# Altium schematic sheet STM32H733_PINOUT.SchDoc
size C; SheetNumber: 3; SheetTotal: 5
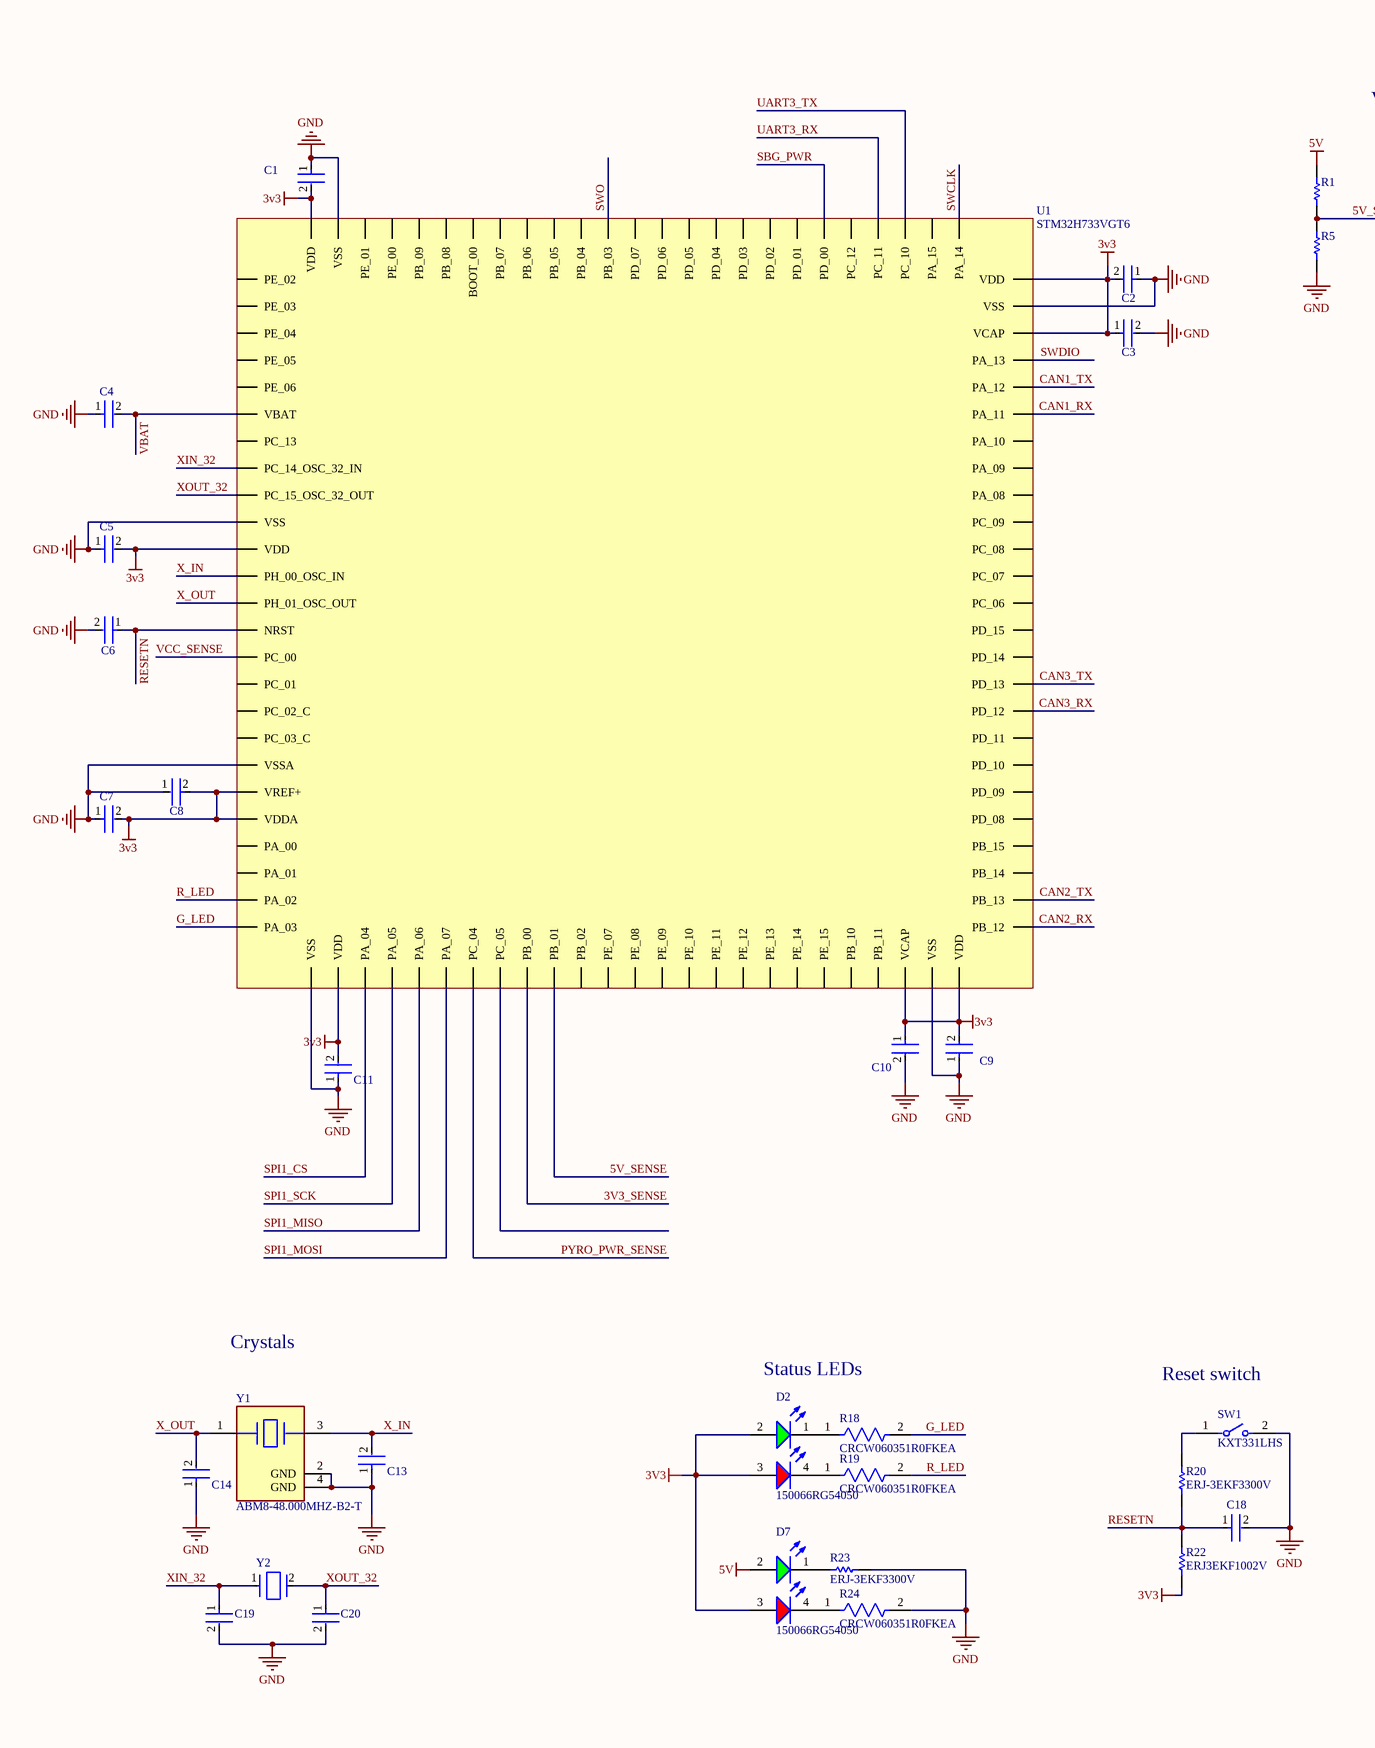
[diagram p0: STM32H733_PINOUT.SchDoc, left]
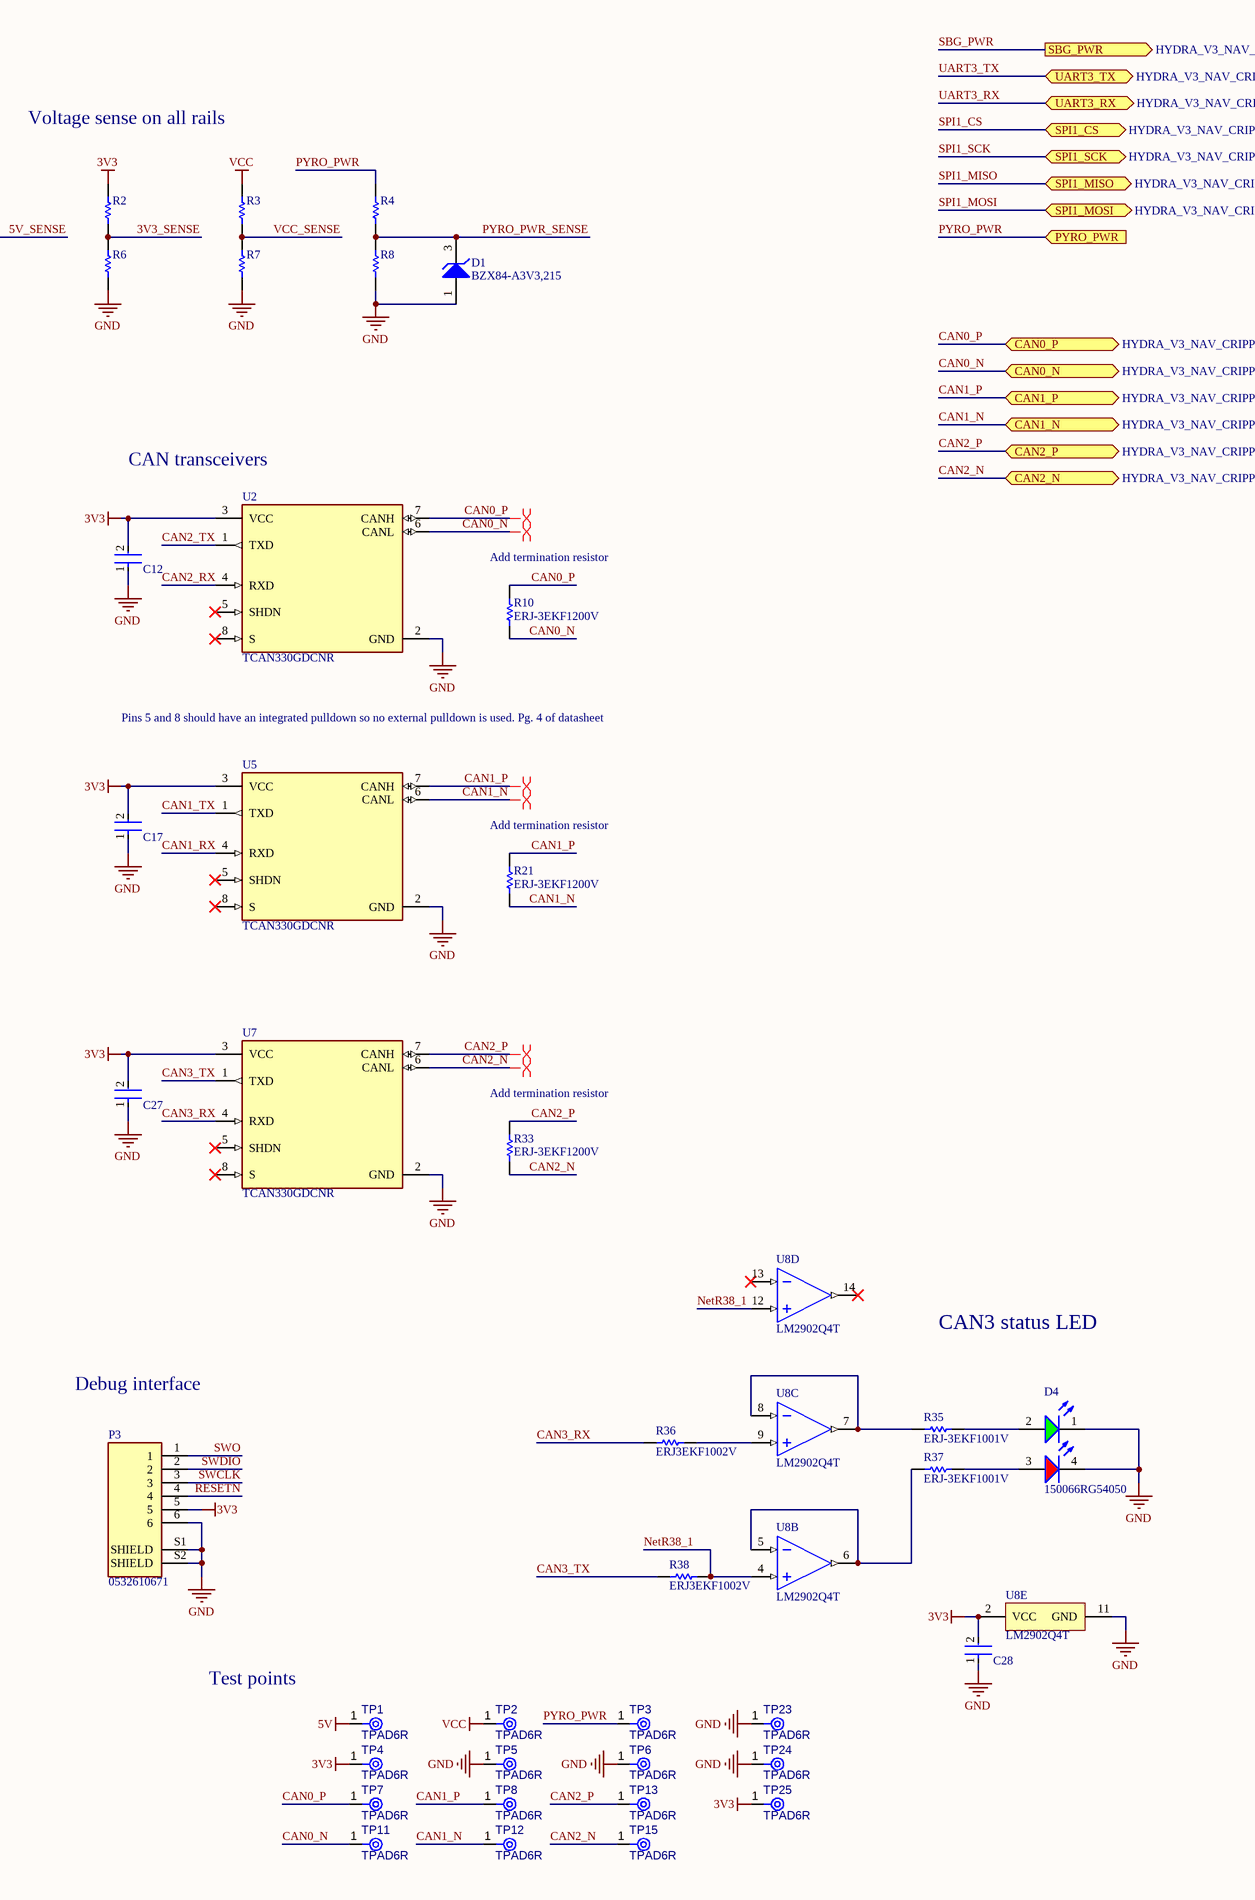
[diagram p1: STM32H733_PINOUT.SchDoc, right]

## Parts
C1  CC0402JRNPO9BN500  [FP-C0402-BB-MFG]  (value not drawn)
C2  CC0402JRNPO9BN500  [FP-C0402-BB-MFG]  (value not drawn)
C3  C1005X7S1A225K050BC  [FP-C1005-050-0_15-0_1-MFG]  (value not drawn)
C4  CC0402JRNPO9BN500  [FP-C0402-BB-MFG]  (value not drawn)
C5  CC0402JRNPO9BN500  [FP-C0402-BB-MFG]  (value not drawn)
C6  C0402C104K8PACTU  [FP-C0402-BB-MFG]  (value not drawn)
C7  CC0402JRNPO9BN500  [FP-C0402-BB-MFG]  (value not drawn)
C8  GRM155R71C104KA88D  [FP-GRM15-MFG]  (value not drawn)
C9  CC0402JRNPO9BN500  [FP-C0402-BB-MFG]  (value not drawn)
C10  C1005X7S1A225K050BC  [FP-C1005-050-0_15-0_1-MFG]  (value not drawn)
C11  CC0402JRNPO9BN500  [FP-C0402-BB-MFG]  (value not drawn)
C12  C0402C104K8PACTU  [FP-C0402-BB-MFG]  (value not drawn)
C13  08051A6R8CAT2A  [FP-0805-L_2_01_0_2-W_1_25-MFG]  (value not drawn)
C14  08051A6R8CAT2A  [FP-0805-L_2_01_0_2-W_1_25-MFG]  (value not drawn)
C17  C0402C104K8PACTU  [FP-C0402-BB-MFG]  (value not drawn)
C18  C0402C104K8PACTU  [FP-C0402-BB-MFG]  (value not drawn)
C19  C0805C180J5GACTU  [FP-C0805C-DN-MFG]  (value not drawn)
C20  C0805C180J5GACTU  [FP-C0805C-DN-MFG]  (value not drawn)
C27  C0402C104K8PACTU  [FP-C0402-BB-MFG]  (value not drawn)
C28  C0402C104K8PACTU  [FP-C0402-BB-MFG]  (value not drawn)
D1  BZX84-A3V3,215  [SOT95P230X110-3N]
D2  150066RG54050  [WL-SBCD_0606]
D4  150066RG54050  [WL-SBCD_0606]
D7  150066RG54050  [WL-SBCD_0606]
P3  0532610671  [0532610671-Footprint-1]
R1  ERJ3EKF1002V  [RESC1609X55X30LL15T15]  (value not drawn)
R2  ERJ3EKF1002V  [RESC1609X55X30LL15T15]  (value not drawn)
R3  ERJ3EKF1002V  [RESC1609X55X30LL15T15]  (value not drawn)
R4  ERJ3EKF1002V  [RESC1609X55X30LL15T15]  (value not drawn)
R5  ERJ3EKF1002V  [RESC1609X55X30LL15T15]  (value not drawn)
R6  ERJ3EKF1002V  [RESC1609X55X30LL15T15]  (value not drawn)
R7  CRCW06032K70JNEA  [RESC1609X50X30ML10T20]  (value not drawn)
R8  CRCW06032K70JNEA  [RESC1609X50X30ML10T20]  (value not drawn)
R10  ERJ-3EKF1200V  [RESC1609X55X30ML15T15]
R18  CRCW060351R0FKEA  [FP-CRCW0603-e3-MFG]
R19  CRCW060351R0FKEA  [FP-CRCW0603-e3-MFG]
R20  ERJ-3EKF3300V  [RESC1608X55X30LL15T15]
R21  ERJ-3EKF1200V  [RESC1609X55X30ML15T15]
R22  ERJ3EKF1002V  [RESC1609X55X30LL15T15]
R23  ERJ-3EKF3300V  [RESC1608X55X30LL15T15]
R24  CRCW060351R0FKEA  [FP-CRCW0603-e3-MFG]
R33  ERJ-3EKF1200V  [RESC1609X55X30ML15T15]
R35  ERJ-3EKF1001V  [RESC1608X55X30LL15T15]
R36  ERJ3EKF1002V  [RESC1609X55X30LL15T15]
R37  ERJ-3EKF1001V  [RESC1608X55X30LL15T15]
R38  ERJ3EKF1002V  [RESC1609X55X30LL15T15]
SW1  KXT331LHS  [FP-KXT331LHS-MFG]
TP1  TPAD6R  [TP06R]  (no BOM)
TP2  TPAD6R  [TP06R]  (no BOM)
TP3  TPAD6R  [TP06R]  (no BOM)
TP4  TPAD6R  [TP06R]  (no BOM)
TP5  TPAD6R  [TP06R]  (no BOM)
TP6  TPAD6R  [TP06R]  (no BOM)
TP7  TPAD6R  [TP06R]  (no BOM)
TP8  TPAD6R  [TP06R]  (no BOM)
TP11  TPAD6R  [TP06R]  (no BOM)
TP12  TPAD6R  [TP06R]  (no BOM)
TP13  TPAD6R  [TP06R]  (no BOM)
TP15  TPAD6R  [TP06R]  (no BOM)
TP23  TPAD6R  [TP06R]  (no BOM)
TP24  TPAD6R  [TP06R]  (no BOM)
TP25  TPAD6R  [TP06R]  (no BOM)
U1  STM32H733VGT6  [STM32H733VGT6-Footprint-1]
U2  TCAN330GDCNR  [FP-DCN0008A-MFG]
U5  TCAN330GDCNR  [FP-DCN0008A-MFG]
U7  TCAN330GDCNR  [FP-DCN0008A-MFG]
U8  LM2902Q4T  [LM2902Q4T-Footprint-1]  (parts B,C,D,E of 5)
Y1  ABM8-48.000MHZ-B2-T  [FP-ABM8-MFG]
Y2  ECS-.327-12.5-1210-TR  [FP-ECX-1210-MFG]  (value not drawn)

## Ports
CAN0_N (bidir, see HYDRA_V3_NAV_CRIPPLED[5B]), CAN0_P (bidir, see HYDRA_V3_NAV_CRIPPLED[5B]), CAN1_N (bidir, see HYDRA_V3_NAV_CRIPPLED[5B]), CAN1_P (bidir, see HYDRA_V3_NAV_CRIPPLED[5B]), CAN2_N (bidir, see HYDRA_V3_NAV_CRIPPLED[5B]), CAN2_P (bidir, see HYDRA_V3_NAV_CRIPPLED[5B]), PYRO_PWR (in, see HYDRA_V3_NAV_CRIPPLED[4B]), SBG_PWR (out, see HYDRA_V3_NAV_CRIPPLED[5A], SBG[6A]), SPI1_CS (bidir, see HYDRA_V3_NAV_CRIPPLED[5B]), SPI1_MISO (bidir, see HYDRA_V3_NAV_CRIPPLED[5B]), SPI1_MOSI (bidir, see HYDRA_V3_NAV_CRIPPLED[5B]), SPI1_SCK (bidir, see HYDRA_V3_NAV_CRIPPLED[5B]), UART3_RX (bidir, see HYDRA_V3_NAV_CRIPPLED[5A]), UART3_TX (bidir, see HYDRA_V3_NAV_CRIPPLED[5A])

## Nets
3v3: C1.2 C2.2 C3.1 C5.2 C7.2 C8.2 C9.2 C10.1 C11.2 C12.2 C17.2 C27.2 C28.2 D2.2(A) D2.3(A) D7.3(A) P3.5 R2.2 R22.1 TP4.1(TP) TP25.1(TP) U1.11(VDD) U1.20(VREF+) U1.21(VDDA) U1.27(VDD) U1.48(VCAP) U1.50(VDD) U1.73(VCAP) U1.75(VDD) U1.100(VDD) U2.3(VCC) U5.3(VCC) U7.3(VCC) U8.2(VCC)
5V: D7.2(A) R1.2 TP1.1(TP)
GND: C1.1 C2.1 C3.2 C4.1 C5.1 C6.2 C7.1 C8.1 C9.1 C10.2 C11.1 C12.1 C13.1 C14.1 C17.1 C18.2 C19.2 C20.2 C27.1 C28.1 D1.1(A) D4.1(K) D4.4(K) P3.6 P3.S1(SHIELD) P3.S2(SHIELD) R5.1 R6.1 R7.1 R8.1 R23.2 R24.2 SW1.2 TP5.1(TP) TP6.1(TP) TP23.1(TP) TP24.1(TP) U1.10(VSS) U1.19(VSSA) U1.26(VSS) U1.49(VSS) U1.74(VSS) U1.99(VSS) U2.2(GND) U5.2(GND) U7.2(GND) U8.11(GND) Y1.2(GND) Y1.4(GND)
VCC: R3.2 TP2.1(TP)
3V3_SENSE: R2.1 R6.2 U1.34(PB_00)
5V_SENSE: R1.1 R5.2 U1.35(PB_01)
CAN0_N: R10.1 TP11.1(TP) U2.6(CANL) ; port CAN0_N
CAN0_P: R10.2 TP7.1(TP) U2.7(CANH) ; port CAN0_P
CAN1_N: R21.1 TP12.1(TP) U5.6(CANL) ; port CAN1_N
CAN1_P: R21.2 TP8.1(TP) U5.7(CANH) ; port CAN1_P
CAN1_RX: U1.70(PA_11) U5.4(RXD)
CAN1_TX: U1.71(PA_12) U5.1(TXD)
CAN2_N: R33.1 TP15.1(TP) U7.6(CANL) ; port CAN2_N
CAN2_P: R33.2 TP13.1(TP) U7.7(CANH) ; port CAN2_P
CAN2_RX: U1.51(PB_12) U2.4(RXD)
CAN2_TX: U1.52(PB_13) U2.1(TXD)
CAN3_RX: R36.1 U1.59(PD_12) U7.4(RXD)
CAN3_TX: R38.2 U1.60(PD_13) U7.1(TXD)
G_LED: R18.2 U1.25(PA_03)
NetR38_1: R38.1 U8.4(2IN+) U8.12(4IN+)
PYRO_PWR: R4.2 TP3.1(TP) ; port PYRO_PWR
PYRO_PWR_SENSE: D1.3(K) R4.1 R8.2 U1.32(PC_04)
R_LED: R19.2 U1.24(PA_02)
RESETN: C6.1 C18.1 P3.4 R20.1 R22.2 U1.14(NRST)
SBG_PWR: U1.81(PD_00) ; port SBG_PWR
SPI1_CS: U1.28(PA_04) ; port SPI1_CS
SPI1_MISO: U1.30(PA_06) ; port SPI1_MISO
SPI1_MOSI: U1.31(PA_07) ; port SPI1_MOSI
SPI1_SCK: U1.29(PA_05) ; port SPI1_SCK
SWCLK: P3.3 U1.76(PA_14)
SWDIO: P3.2 U1.72(PA_13)
SWO: P3.1 U1.89(PB_03)
UART3_RX: U1.79(PC_11) ; port UART3_RX
UART3_TX: U1.78(PC_10) ; port UART3_TX
VBAT: C4.2 U1.6(VBAT)
VCC_SENSE: R3.1 R7.2 U1.15(PC_00)
X_IN: C13.2 U1.12(PH_00_OSC_IN) Y1.3
X_OUT: C14.2 U1.13(PH_01_OSC_OUT) Y1.1
XIN_32: C19.1 U1.8(PC_14_OSC_32_IN) Y2.1(In/Out)
XOUT_32: C20.1 U1.9(PC_15_OSC_32_OUT) Y2.2(Out/In)
NetD2_1: D2.1(K) R18.1
NetD2_4: D2.4(K) R19.1
NetD4_2: D4.2(A) R35.2
NetD4_3: D4.3(A) R37.2
NetD7_1: D7.1(K) R23.1
NetD7_4: D7.4(K) R24.1
NetR20_2: R20.2 SW1.1
NetR35_1: R35.1 U8.7(3OUT) U8.8(3IN-)
NetR36_2: R36.2 U8.9(3IN+)
NetR37_1: R37.1 U8.5(2IN-) U8.6(2OUT)

Not connected (* = marked no-connect by the designer): U1 1(PE_02) 2(PE_03) 3(PE_04) 4(PE_05) 5(PE_06) 7(PC_13) 16(PC_01) 17(PC_02_C) 18(PC_03_C) 22(PA_00) 23(PA_01) 33(PC_05) 36(PB_02) 37(PE_07) 38(PE_08) 39(PE_09) 40(PE_10) 41(PE_11) 42(PE_12) 43(PE_13) 44(PE_14) 45(PE_15) 46(PB_10) 47(PB_11) 53(PB_14) 54(PB_15) 55(PD_08) 56(PD_09) 57(PD_10) 58(PD_11) 61(PD_14) 62(PD_15) 63(PC_06) 64(PC_07) 65(PC_08) 66(PC_09) 67(PA_08) 68(PA_09) 69(PA_10) 77(PA_15) 80(PC_12) 82(PD_01) 83(PD_02) 84(PD_03) 85(PD_04) 86(PD_05) 87(PD_06) 88(PD_07) 90(PB_04) 91(PB_05) 92(PB_06) 93(PB_07) 94(BOOT_00) 95(PB_08) 96(PB_09) 97(PE_00) 98(PE_01); U2 5(SHDN)* 8(S)*; U5 5(SHDN)* 8(S)*; U7 5(SHDN)* 8(S)*; U8 13(4IN-)* 14(4OUT)*

## Layout directives
differential pair: CAN0_N, CAN0_P, CAN1_N, CAN1_P, CAN2_N, CAN2_P

## Notes on the sheet
- Voltage sense on all rails
- (near U2) CAN transceivers
- (near R10) Add termination resistor
- Pins 5 and 8 should have an integrated pulldown so no external pulldown is used. Pg. 4 of datasheet
- (near R21) Add termination resistor
- (near R33) Add termination resistor
- CAN3 status LED
- Crystals
- Status LEDs
- (near SW1) Reset switch
- Debug interface
- Test points

## Library data of the parts
C1 C2 C4 C5 C7 C9 C11 = CMP-2008-02046-2: Actually CC0402JRNPO9BN500; Manufacturer: Kemet; Manufacturer Part Number: C0402C104K8PACTU; Material: Ceramic; Capacitance: 50 pF; Temperature Characteristic: X5R; Temperature Coefficient: 15%; Tolerance: 0.1; Voltage Rating: 10 V; Value: 50 pF; Package: C0402-BB; Temperature: -55°C to +125°C; ComponentLink2Description: Datasheet; Device Class L1: Passive Components; Height: 0.55mm; Lead Free: Yes; ComponentLink2URL: https://content.kemet.com/datasheets/KEM_C1002_X7R_SMD.pdf; Device Class L2: Capacitors; Temperature Range Low: -55°C; Temperature Range High: +125°C; RoHS: TRUE; Octopart: https://octopart.com/c0402c104k8pactu-kemet-140039; Automotive: No; Mouser Description: Capacitor 100 nF 10 VDC 0402; Category: Cap; Digikey Description: CAP CER 0.1UF 10V X5R 0402; Ipc Land Pattern Name: CAPC10050X50; Device Class L3: Ceramic Capacitors
C3 C10 = CMP-08246-004344-1: CAP CER 2.2UF 10V X7S 0402; Dielectric Material: Ceramic; Tolerance: 10%; Mount: Surface Mount; Height: 0.5mm; Package Quantity: 1; Depth: 0.5mm; RoHS Compliant: Yes; Length: 1mm; Thickness: 0.022inch; Packaging: Tape and Reel; Capacitance: 2.2uF; Case Code (Imperial): 0402; Resistor Type: Ceramic; Dielectric: X7S; Case/Package: 0402; Min Operating Temperature: -55°C; Voltage Rating: 10V; Series: C; Weight: 2.3E-05oz; Width: 0.02inch; Voltage Rating (DC): 10V; Case Code (Metric): 1005; Max Operating Temperature: 125°C; Termination: SMD/SMT; Lead Free: Lead Free
C6 C12 C17 C18 C27 C28 = CMP-2008-02046-2: CAP CER 0.1UF 10V X5R 0402; Manufacturer: Kemet; Material: Ceramic; Capacitance: 0.10 μF; Temperature Coefficient: 15%; Tolerance: 0.1; Value: 0.10 μF; Package: C0402-BB; Temperature: -55°C to +125°C; ComponentLink2Description: Datasheet; Temperature Characteristic: X5R; Device Class L1: Passive Components; Height: 0.55mm; Lead Free: Yes; ComponentLink2URL: https://content.kemet.com/datasheets/KEM_C1002_X7R_SMD.pdf; Device Class L2: Capacitors; Temperature Range Low: -55°C; Temperature Range High: +125°C; RoHS: TRUE; Octopart: https://octopart.com/c0402c104k8pactu-kemet-140039; Automotive: No; Mouser Description: Capacitor 100 nF 10 VDC 0402; Category: Cap; Voltage Rating: 10 V; Digikey Description: CAP CER 0.1UF 10V X5R 0402; Ipc Land Pattern Name: CAPC10050X50; Device Class L3: Ceramic Capacitors; Manufacturer Part Number: C0402C104K8PACTU
C8 = CMP-2100-03641-2: CAP CER 0.1UF 16V X7R 0402; Manufacturer: Murata; Standoff Height: 0mm; Tolerance: 10%; Voltage Rating: 16Vdc; Material: Ceramic; Capacitance: 0.10μF; Value: 0.10μF; RoHS: TRUE; Manufacturer Part Number: GRM155R71C104KA88D; Temperature Characteristic: X7R; Octopart: https://octopart.com/grm155r71c104ka88d-murata-196880; Digikey Description: CAP CER 0.1UF 16V X7R 0402; Device Class L3: Ceramic Capacitors; Height: 0.55mm; ComponentLink2Description: Datasheet; Temperature Range Low: -55°C; Ipc Land Pattern Name: CAPC10050X219; ComponentLink2URL: https://search.murata.co.jp/Ceramy/image/img/A01X/G101/ENG/GRM155R71H471KA01-01A.pdf; Device Class L1: Passive Components; Lead Free: yes; Category: Cap; Package: GRM15; Temperature: -55°C to +125°C; Device Class L2: Capacitors; Temperature Range High: +125°C; Mouser Description: 0402 0.1 uF 16V ±10 % Tolerance X7R SMT Multilayer Ceramic Capacitor
C13 C14 = CMP-1036-00709-3: General Purpose Ceramic Capacitor, 0805, 6.8pF, 0.25pF, C0G, 30ppm/°C, 100V; Dissipation Factor: 10%; Insulation Resistance: 100GR; Tolerance: 5%; Max Operating Temperature: 125°C; RoHS Compliant: Yes; Capacitance: 6.8pF; Termination: SMD/SMT; Number of Pins: 2; Packaging: Tape and Reel; Mount: Surface Mount; Case Code (Metric): 2012; Case Code (Imperial): 0805; Height: 0.71mm; Min Operating Temperature: -55°C; Width: 0.049inch; Temperature Coefficient: 0ppm/°C; Length: 2.01mm; Dielectric: C0G; Series: -; Voltage Rating (DC): 100V; Dielectric Material: Ceramic; Depth: 1.25mm; Contact Plating: Tin; Voltage Rating: 100V; Thickness: 0.037inch; Case/Package: 0805; Lead Free: Lead Free; Radiation Hardening: No; Voltage: 100V; Construction: Flat; Package Quantity: 1; REACH SVHC: No SVHC
C19 C20 = CMP-2007-00302-2: CAP CER 18PF 50V C0G/NP0 0805; Manufacturer: KEMET; Temperature Characteristic: C0G; Tolerance: 0.05; Material: Ceramic; Temperature Coefficient: 30ppm/°C; Device Class L2: Capacitors; Capacitance: 18 pF; Temperature: -55°C to +125°C; Value: 18 pF; Package: C0805C-DN; Mouser Description: Cap Ceramic 18pF 50V C0G 5% SMD 0805 125C Paper T/R; Height: 0.88mm; ComponentLink2URL: https://content.kemet.com/datasheets/KEM_C1003_C0G_SMD.pdf; RoHS: TRUE; Octopart: https://octopart.com/c0805c180j5gactu-kemet-144810; ComponentLink2Description: Datasheet; Temperature Range High: +125°C; Digikey Description: CAP CER 18PF 50V C0G/NP0 0805; Device Class L1: Passive Components; Category: Cap; Automotive: No; Device Class L3: Ceramic Capacitors; Voltage Rating: 50 V; Temperature Range Low: -55°C; Ipc Land Pattern Name: CAPC200125X78; Lead Free: Yes; Manufacturer Part Number: C0805C180J5GACTU
D1 = CMP-004-00035-1: DIODE ZENER 3.3V 250MW SOT23
D2 D4 D7 = CMP-004-00034-2: Led, Red/Grn, 180Mcd/230Mcd, 624Nm/525Nm Rohs Compliant: Yes
P3 = CMP-002-00079-1: Conn Shrouded Header (4 Sides) HDR 6 POS 1.25mm Solder RA Side Entry SMD PicoBlade™ T/R
R1-R6 R22 R36 R38 = CMP-1012-00623-3: Chip Resistor, 10 KOhm, +/- 1%, 0.1 W, -55 to 155 degC, 0603 (1608 Metric), RoHS, Tape and Reel; Manufacturer: Panasonic; Voltage Rating: 75V; Case\/Package: 0603; Power Rating: 100mW; Resistance: 10KOhm; Temperature Coefficient: 100ppm\/degreesC; Number of Pins: 2; Package Reference: 603; Depth: 0.8mm; Mount: SurfaceMount; Package Description: 2-Pin Surface Mount Device, Body 1.6 x 0.85 mm; Datasheet Version: 02/2017; Length: 1.6mm; Lead Free: LeadFree; Height: 0.45mm; Number of Terminations: 2; Max Power Dissipation: 100mW; Min Operating Temperature: -55degC; Datasheet URL: https://industrial.panasonic.com/cdbs/www-data/pdf/RDA0000/AOA0000C304.pdf; Termination: SMD/SMT; Case Code (Metric): 1608; Case Code (Imperial): 0603; Tolerance: 1%; Max Operating Temperature: 155degC; RoHSCompliant: true; Voltage Rating (DC): 75V; Radiation Hardening: No; Packaging: TapeandReel; Composition: ThickFilm; Mounting Technology: SurfaceMount; Manufacturer URL: http://www.panasonic.com/; Width: 0.031inch; REACH SVHC: NoSVHC; Contact Plating: Tin; Military Standard: Not; Package Quantity: 1
R7 R8 = CMP-2000-03183-1: Manufacturer: Vishay Dale; Part Number: CRCW06032K70JNEA
R10 R21 R33 = CMP-2000-00213-2: Chip Resistor, 120 Ohm, +/- 1%, 0.1 W, -55 to 155 degC, 0603 (1608 Metric), RoHS, Tape and Reel; Manufacturer: Panasonic; Power Rating: 100mW; Voltage Rating (DC): 75V; Resistance: 120Ohm; Temperature Coefficient: 100ppm/degreesC; Number of Terminations: 2; Military Standard: Not; Tolerance: 1%; Min Operating Temperature: -55degC; Packaging: TapeandReel; Lead Free: LeadFree; Max Operating Temperature: 155degC; Manufacturer URL: http://www.panasonic.com/; Case Code (Imperial): 0603; REACH SVHC: NoSVHC; Width: 0.031inch; Datasheet URL: https://industrial.panasonic.com/cdbs/www-data/pdf/RDA0000/AOA0000C283.pdf; RoHSCompliant: true; Max Power Dissipation: 100mW; Termination: SMD/SMT; Package Reference: 0603; Height: 0.022inch; Depth: 0.8mm; Package Description: 2-Pin Surface Mount Device, Body 1.6 x 0.85 mm; Contact Plating: Tin; Length: 1.6mm; Package URL: http://www.st.com/st-web-ui/static/active/en/resource/technical/document/datasheet/CD00001320.pdf; Radiation Hardening: No; Package Quantity: 1; Number of Pins: 2; Datasheet Version: 42095.0; Voltage Rating: 75V; Composition: ThickFilm; Case/Package: 0603; Mount: SurfaceMount; Case Code (Metric): 1608
R18 R19 R24 = CMP-2000-03446-2: RES Thick Film, 51Ω, 1%, 0.1W, 100ppm/°C, 0603; Power Rating: 100mW; Voltage Rating: 75V; Resistance: 51R; Military Standard: Not; Case Code (Imperial): 0603; Max Operating Temperature: 155°C; Temperature Coefficient: 100ppm/°C; Lead Free: Lead Free; Weight: 7.1E-05oz; Number of Pins: 2; Package Quantity: 10; Case/Package: 0603; Termination: SMD/SMT; Min Operating Temperature: -55°C; Tolerance: 1%; Contact Plating: Tin; Height: 0.45mm; Working Voltage: 75V; Radiation Hardening: No; Packaging: Tape and Reel; Composition: Thick Film; Max Power Dissipation: 100mW; Width: 0.85mm; Depth: 0.85mm; Length: 1.55mm; Case Code (Metric): 1608; Voltage Rating (DC): 75V; Number of Terminations: 2; Features: Automotive AEC-Q200
R20 R23 = CMP-2000-00435-2: Chip Resistor, 330 Ohm, +/- 1%, 0.1 W, -55 to 155 degC, 0603 (1608 Metric), RoHS, Tape and Reel; Gender: Male; Mating Cycles: 10000; Current Rating: 500 mA; Voltage Rating: 10 V; REACH SVHC: No SVHC; PackageDescription: 2-Pin Surface Mount Device, Body 1.6 x 0.85 mm; Contact Finish: Gold; Pins: 8; ComponentLink1Description: Manufacturer URL; Packaging: Tape and Reel; Max Operating Temperature: 85 degC; Contact Material: Copper; Height: 1.45 mm; Width: 1.45 mm; DatasheetVersion: Apr-15; Package Quantity: 1500; Contact Plating: Gold; PackageReference: 0603; Mount: Surface Mount; Lead Pitch: 1.1 mm; Min Operating Temperature: -25 degC; ComponentLink1URL: http://www.panasonic.com/; ComponentLink2URL: http://industrial.panasonic.com/cdbs/www-data/pdf/RDA0000/AOA0000C86.pdf; Length: 13.7 mm; ComponentLink2Description: Datasheet; RoHSCompliant: true
R35 R37 = CMP-2000-00180-1: Manufacturer: Panasonic; Part Number: ERJ-3EKF1001V
SW1 = CMP-10040-000029-1: SWITCH TACTILE SPST-NO 0.02A 15V; Operating Force: 240gf; Switch Travel: 0.13mm; Illumination Type: Non-Illuminated; Throw Configuration: SPST; Number of Ports: 1; Current Rating: 5A; Mechanical Life: 500000Cycles; Switch Function: Off-Mom; Connector Type: USB; Actuator Type: Standard; Gender: Receptacle; Number of Contacts: 24; Contact Plating: Gold; Insulation Color: Black; Min Operating Temperature: -40°C; Packaging: Tape and Reel; Flammability Rating: UL94 V-0; Max Operating Temperature: 85°C; Termination: Solder; Mount: Surface Mount
TP1-TP8 TP11-TP13 TP15 TP23-TP25 = CMP-00028-00002-2: 0.6mm round; Pins: 1
U1 = CMP-020-00024-1: MCU 32-bit ARM Cortex M7 RISC 1MB Flash 1.8V/2.5V/3.3V 100-Pin LQFP Tray
U2 U5 U7 = CMP-04872-000178-1: IC TRANSCEIVER 1/1 SOT23-8; Data Rate: 1Mbps; Packaging: Tape and Reel; Min Operating Temperature: -40°C; Max Operating Temperature: 125°C; RoHS Compliant: Yes; Lead Free: Lead Free; Case/Package: SOT-23-8; Mount: Surface Mount
U8 = CMP-014-00004-1: LM2902 Series 30 V 1.3 MHz Low-Power Quad Operational Amplifier - QFN-16 (3x3)
Y1 = CMP-27762-011708-1: Crystal 48MHz ±20ppm 18pF SMD-4 3.2mm x 2.5mm; Series Resistance: 35R; Frequency Stability: 50ppm; Package Quantity: 1000; Packaging: Tape and Reel; Mount: Surface Mount; Length: 3.2mm; Load Capacitance: 18pF; Max Operating Temperature: 70°C; Operating Frequency: 48 MHz; RoHS Compliant: Yes; Series: ABM8; Frequency Tolerance: 20ppm; Lead Free: Lead Free; Min Operating Temperature: -20°C; Case/Package: CSMD; Number of Pins: 4; Height: 0.031inch; ESR (Equivalent Series Resistance): 35R; Frequency: 48MHz; Radiation Hardening: No; Width: 0.098inch; Tolerance: 20ppm; Termination: SMD/SMT; Depth: 2.5mm; Resistor Type: Ceramic; REACH SVHC: No SVHC
Y2 = CMP-40224-000006-1: CRYSTAL 32.7680KHZ 12.5PF SMD; Manufacturer: ECS International; Frequency: 32.768kHz; Esr: 90kΩ; Tolerance: 20ppm; Device Class L1: Passive Components; Load Capacitance: 12.5pF; Temperature: -40°C to +85°C; ComponentLink2URL: https://ecsxtal.com/store/pdf/ECX-1210.pdf; Series: ECX-1210; Octopart: https://octopart.com/ecs-.327-12.5-1210-tr-ecs+international-81221340; ComponentLink2Description: Datasheet; Temperature Range Low: -40°C; Digikey Description: CRYSTAL 32.7680KHZ 12.5PF SMD; Lead Free: Yes; RoHS: TRUE; Device Class L3: Crystals; Automotive: No; Category: Crys; Height: 0.5mm; Manufacturer Part Number: ECS-.327-12.5-1210-TR; Temperature Range High: +85°C; Device Class L2: Crystals / Oscillators; Package: ECX-1210